# EAGLE design MAPLE-IR-V01 (EAGLE 7.3.0)
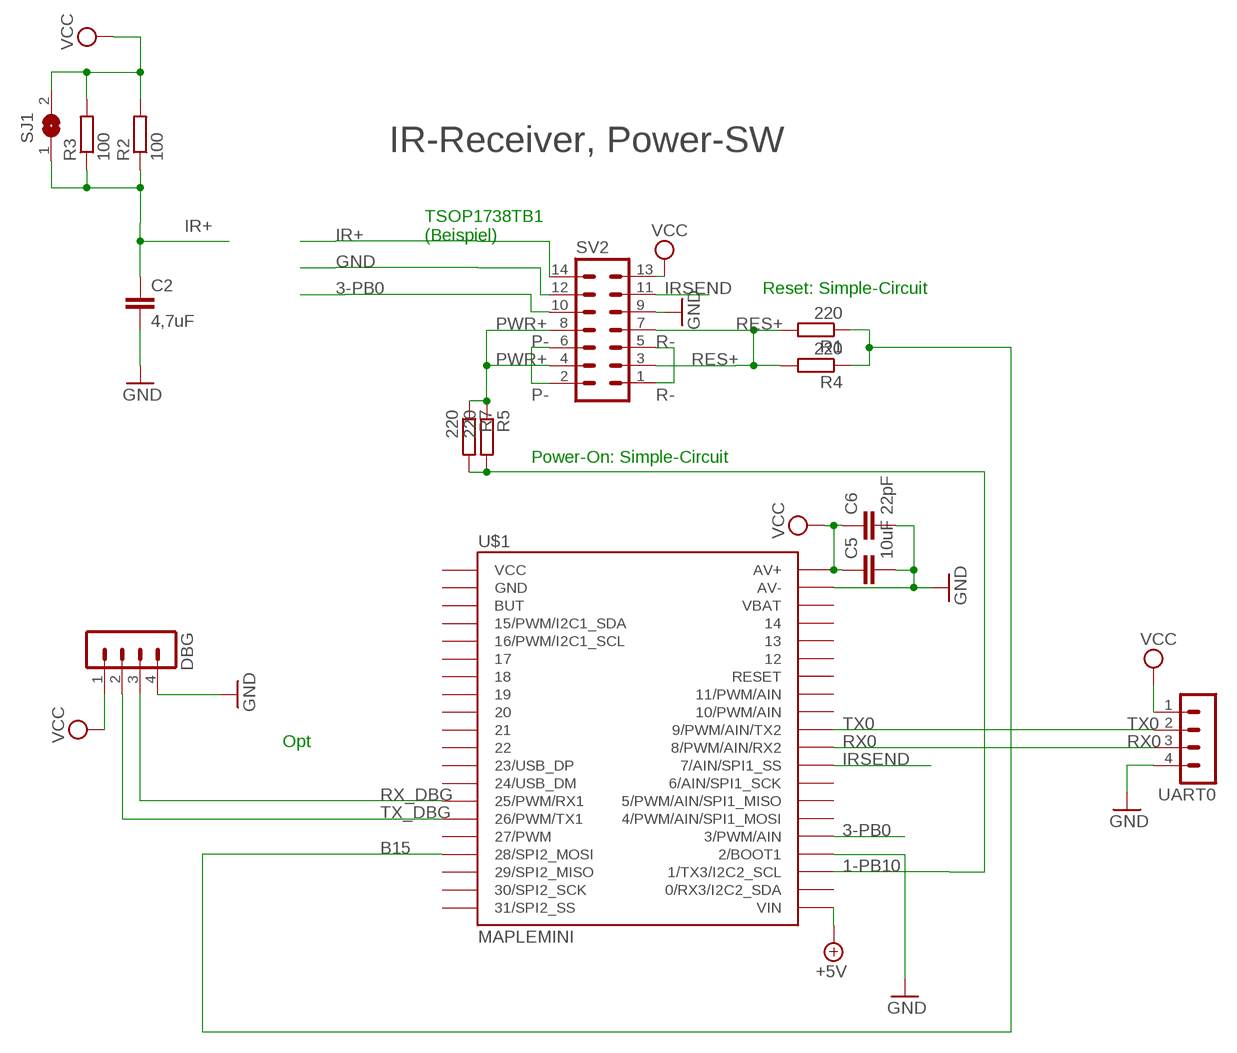
[diagram p0: schematic, sheet 1]

## Parts
C2  4,7uF  C-EUC1206K  [C1206K]
C5  10uF  C-EUC1210  [C1210]
C6  22pF  C-EUC0805  [C0805]
DBG  MA04-1  [MA04-1]
R1  220  R-EU_0204/7  [0204/7]
R2  100  R-EU_0204/7  [0204/7]
R3  100  R-EU_R0805W  [R0805W]
R4  220  R-EU_R0805W  [R0805W]
R5  220  R-EU_0204/7  [0204/7]
R7  220  R-EU_R0805W  [R0805W]
SJ1  SJ  [SJ]
SV2  MA07-2  [MA07-2]
U$1  MAPLEMINI  [20-DIP]
UART0  MA04-1  [MA04-1]

## Nets
1-PB10: R5.2 R7.2 U$1.23(1/TX3/I2C2_SCL)
3-PB0: SV2.10 U$1.25(3/PWM/AIN)
+5V: U$1.21(VIN)
B15: R1.1 R4.1 U$1.17(28/SPI2_MOSI)
GND: C2.2 C5.2 C6.2 DBG.4 SV2.9 SV2.12 U$1.24(2/BOOT1) U$1.39(AV-) UART0.4
IR+: C2.1 R2.1 R3.1 SJ1.1 SV2.14
IRSEND: SV2.11 U$1.29(7/AIN/SPI1_SS)
P-: SV2.2 SV2.6
PWR+: R5.1 R7.1 SV2.4 SV2.8
R-: SV2.1 SV2.5
RES+: R1.2 R4.2 SV2.3 SV2.7
RX0: U$1.30(8/PWM/AIN/RX2) UART0.3
RX_DBG: DBG.3 U$1.14(25/PWM/RX1)
TX0: U$1.31(9/PWM/AIN/TX2) UART0.2
TX_DBG: DBG.2 U$1.15(26/PWM/TX1)
VCC: C5.1 C6.1 DBG.1 R2.2 R3.2 SJ1.2 SV2.13 U$1.40(AV+) UART0.1
Unconnected: U$1.1(VCC) U$1.2(GND) U$1.3(BUT) U$1.4(15/PWM/I2C1_SDA) U$1.5(16/PWM/I2C1_SCL) U$1.6 U$1.7 U$1.8 U$1.9 U$1.10 U$1.11 U$1.12(23/USB_DP) U$1.13(24/USB_DM) U$1.16(27/PWM) U$1.18(29/SPI2_MISO) U$1.19(30/SPI2_SCK) U$1.20(31/SPI2_SS) U$1.22(0/RX3/I2C2_SDA) U$1.26(4/PWM/AIN/SPI1_MOSI) U$1.27(5/PWM/AIN/SPI1_MISO) U$1.28(6/AIN/SPI1_SCK) U$1.32(10/PWM/AIN) U$1.33(11/PWM/AIN) U$1.34(RESET) U$1.35 U$1.36 U$1.37 U$1.38(VBAT)

## Notes on the sheet
- IR-Receiver, Power-SW
- TSOP1738TB1
  (Beispiel)
- Reset: Simple-Circuit
- Power-On: Simple-Circuit
- Opt

## Library data of the parts
C2 C5 C6 = rcl:C-EU: CAPACITOR, European symbol
DBG UART0 = con-lstb:MA04-1: PIN HEADER; OC_FARNELL: unknown; OC_NEWARK: unknown
R1-R5 R7 = rcl:R-EU_: RESISTOR, European symbol
SJ1 = jumper:SJ: SMD solder JUMPER
SV2 = con-lstb:MA07-2: PIN HEADER; OC_FARNELL: unknown; OC_NEWARK: unknown
U$1 = maplemini-small:MAPLEMINI

## Net classes
0 default: width 0.406 mm
1 PWR: width 0.305 mm

## Board
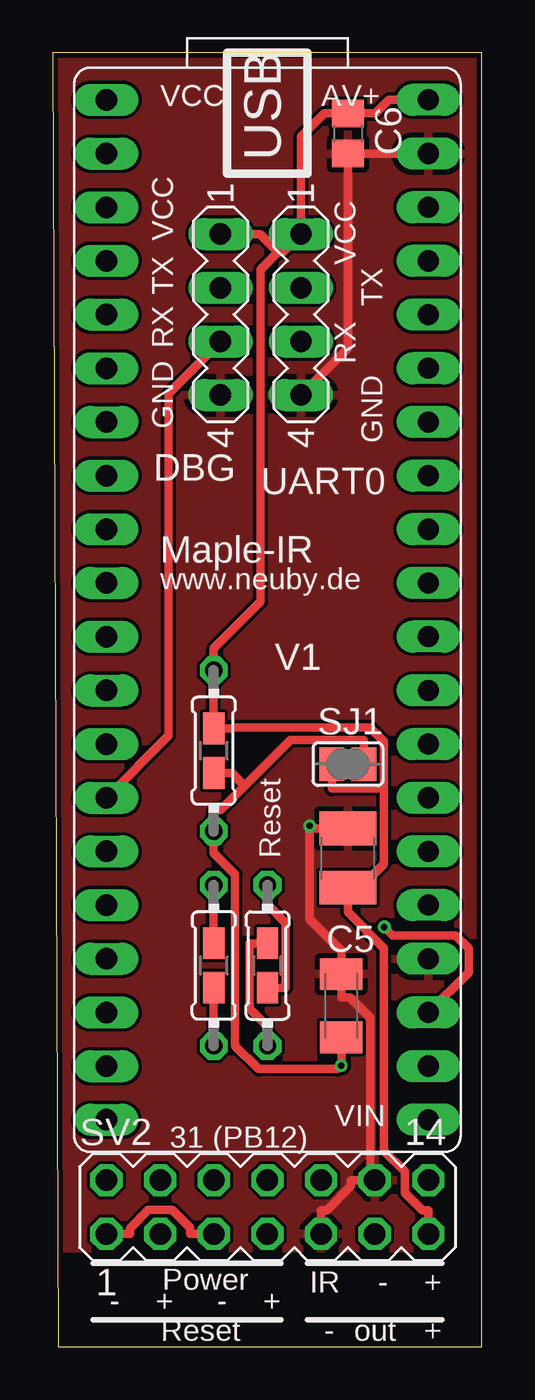
[diagram p1: board, top side]
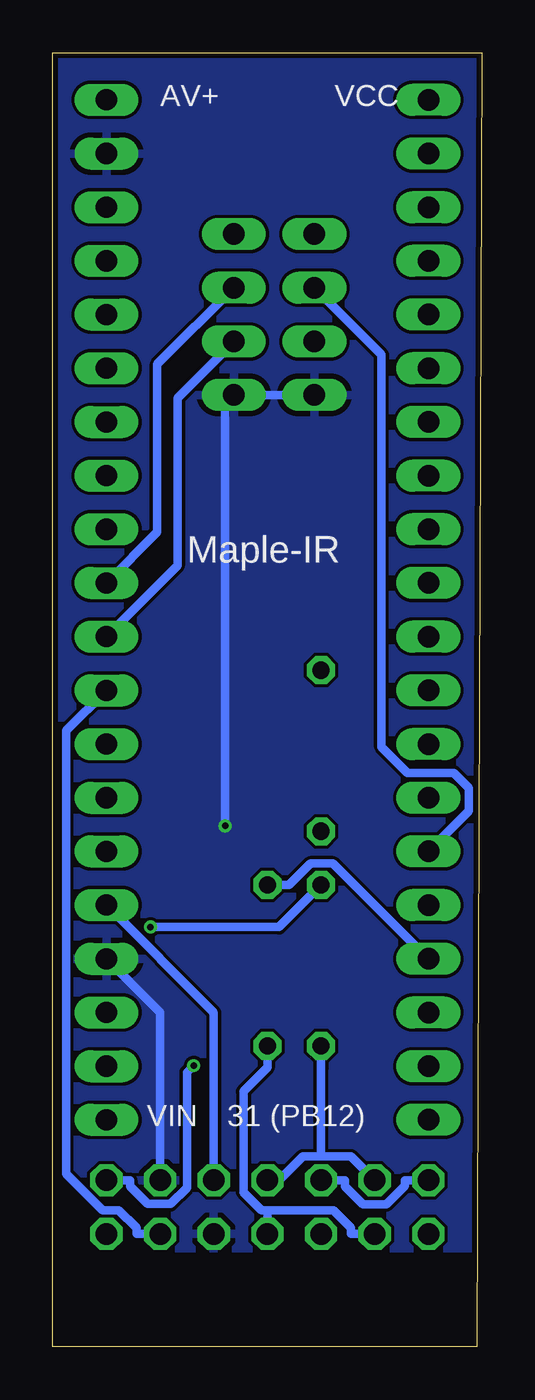
[diagram p2: board, bottom side, seen from below]

Size 20.32 x 61.21 mm. Coordinates in mm from the lower left corner, seen from the top.
Outline: 0,61.21 0.25,0 20.32,0 20.32,61.21 0,61.21
Copper layers (1*16): Top 0.035mm / dielectric 1.5mm / Bottom 0.035mm
Design rules "SeeedStudio_2layer_DRU_no_angle_20140221": minimum track width 6mil, minimum drill 12mil, track to track 6mil, track to pad 6mil, pad to pad 6mil, via to via 6mil, smd to smd 0mil, copper to edge 10mil, drill to drill 10mil, minimum pad ring 10mil, minimum via ring 6mil, stop-mask expansion 2mil, vias tented up to drill 100mil, thermal gap 10mil
tRestrict: area 0.3,0 to 20.3,4.3
bRestrict: area 0.3,0 to 20.3,4.3

### Footprints (pad centres in the part's own frame; a part is rotated, then mirrored left to right if it is on the bottom)
C1206K = smd 1.5 x 2: 1 -1.5,0; 2 1.5,0
C1210 = smd 1.6 x 2.7: 1 -1.4,0; 2 1.4,0
C0805 = smd 1.3 x 1.5: 1 -0.95,0; 2 0.95,0
MA04-1 = drill 1.016 long: 1 -3.81,0; 2 -1.27,0; 3 1.27,0; 4 3.81,0
0204/7 = drill 0.813 octagon: 1 -3.81,0; 2 3.81,0
R0805W = smd 1.5 x 1: 1 -1.052,0; 2 1.052,0
SJ = smd 1.168 x 1.6: 1 -0.762,0; 2 0.762,0
MA07-2 = drill 1.016 octagon: 1 -7.62,-1.27; 2 -7.62,1.27; 3 -5.08,-1.27; 4 -5.08,1.27; 5 -2.54,-1.27; 6 -2.54,1.27; 7 0,-1.27; 8 0,1.27; 9 2.54,-1.27; 10 2.54,1.27; 11 5.08,-1.27; 12 5.08,1.27; 13 7.62,-1.27; 14 7.62,1.27
20-DIP = drill 1.016 pad 1.27 long: 1 -24.13,-7.62; 2 -21.59,-7.62; 3 -19.05,-7.62; 4 -16.51,-7.62; 5 -13.97,-7.62; 6 -11.43,-7.62; 7 -8.89,-7.62; 8 -6.35,-7.62; 9 -3.81,-7.62; 10 -1.27,-7.62; 11 1.27,-7.62; 12 3.81,-7.62; 13 6.35,-7.62; 14 8.89,-7.62; 15 11.43,-7.62; 16 13.97,-7.62; 17 16.51,-7.62; 18 19.05,-7.62; 19 21.59,-7.62; 20 24.13,-7.62 | drill 1 pad 1.27 long: 21 24.13,7.62; 22 21.59,7.62; 23 19.05,7.62; 24 16.51,7.62; 25 13.97,7.62; 26 11.43,7.62; 27 8.89,7.62; 28 6.35,7.62; 29 3.81,7.62; 30 1.27,7.62; 31 -1.27,7.62; 32 -3.81,7.62; 33 -6.35,7.62; 34 -8.89,7.62; 35 -11.43,7.62; 36 -13.97,7.62; 37 -16.51,7.62; 38 -19.05,7.62; 39 -21.59,7.62; 40 -24.13,7.62

### Placement (x,y rotation side)
C2  13.65,16.13 90 top
C5  13.97,23.11 90 top
C6  13.97,57.4 270 top
DBG  7.94,48.83 270 top
R1  10.16,18.03 270 top
R2  7.62,28.19 90 top
R3  7.62,28.19 90 top
R4  10.16,18.03 90 top
R5  7.62,18.03 90 top
R7  7.62,18.03 90 top
SJ1  13.97,27.56 180 top
SV2  10.16,6.6 0 top
U$1  10.16,34.86 270 top
UART0  11.75,48.83 270 top

### Tracks (layer width: path | path; a pad name or v marks a point on that pad's centre or on a via)
1-PB10  (via drill 0.3 pad 0.61)
  Top 0.406: U$1.23 19.68,17.71 19.68,18.84 19.06,19.46 16.08,19.46 v15.69,19.85 | R7.2 R5.2
  Bottom 0.406: R5.2 9.61,19.85 v15.69,19.85
3-PB0
  Bottom 0.406: U$1.25 12.7,15.81 SV2.10
B15
  Top 0.406: R4.1 11.02,16.98 11.02,20.06 10.25,20.83 10.16,20.83 R1.1
  Bottom 0.406: R1.1 9.14,21.84 8.13,22.86 7.05,22.86 U$1.17
GND  (via drill 0.3 pad 0.61)
  Top 0.406: C6.2 | UART0.4 13.97,47.24 C6.2 | C6.2 15.92,56.45 U$1.39 | C5.2 12.26,24.51 12.26,24.54 v12.16,24.64 12.16,20.23 13.65,18.73 C2.2 13.65,16.52 14.06,16.52 15.03,15.55 15.03,7.97 15.13,7.87 | SV2.12 15.13,7.87 | 15.13,7.87 15.04,7.87 14.12,7.87 14.12,7.6 12.97,6.45 12.7,6.45 SV2.9
  Bottom 0.406: DBG.4 UART0.4 12.16,44.61 v12.16,24.64 | U$1.24 15.24,15.81 SV2.12
  pour Bottom: 0,61.21 0,2.79 20.32,2.79 20.32,61.21
  pour Top: 0,61.21 0,2.79 20.32,2.79 20.32,61.21
IR+  (via drill 0.3 pad 0.61)
  Top 0.406: 9.08,26.54 7.94,25.4 7.62,25.4 R2.1 7.62,23.37 8.64,22.35 8.64,14.24 9.74,13.13 13.48,13.13 v13.65,13.3 C2.1 | 9.08,26.54 11.25,28.71 14.73,28.71 SJ1.1 | 9.08,26.54 8.48,27.14 R3.1
  Bottom 0.406: SV2.14 16.66,7.87 16.66,7.6 15.82,6.76 14.73,6.76 13.97,7.52 13.97,12.98 v13.65,13.3
IRSEND
  Bottom 0.406: SV2.11 16.36,5.33 16.36,5.61 17.2,6.45 17.95,6.45 19.68,8.18 19.68,29.15 U$1.29
P-
  Bottom 0.406: SV2.2 3.66,7.87 3.66,7.6 4.52,6.74 5.65,6.74 6.5,7.6 6.5,7.87 SV2.6
PWR+
  Top 0.406: R7.1 R5.1
  Bottom 0.406: 7.62,9 6.2,9 SV2.4 | 7.62,9 8.48,9 9.6,7.87 SV2.8 | 7.62,9 7.62,13.21 R5.1
R-
  Top 0.406: SV2.1 3.66,5.33 3.66,5.61 4.52,6.47 5.65,6.47 6.5,5.61 6.5,5.33 SV2.5
RES+
  Top 0.406: R4.2 9.3,19.09 9.3,16.01 10.07,15.24 10.16,15.24 R1.2
  Bottom 0.406: 10.16,6.45 10.44,6.45 11.29,7.31 11.29,12.07 10.16,13.21 R1.2 | SV2.3 6.2,5.33 6.2,5.61 7.04,6.45 10.16,6.45 | SV2.7 10.16,6.45
RX0
  Bottom 0.406: UART0.3 14.42,44.89 14.42,36.95 U$1.30
RX_DBG
  Top 0.406: U$1.14 5.47,28.91 5.47,45.1 DBG.3
TX0
  Bottom 0.406: U$1.31 15.37,38.54 15.37,46.48 | 15.37,46.48 | 15.37,46.48 UART0.2
TX_DBG
  Bottom 0.406: U$1.15 0.62,25.35 0.62,26.44 1.32,27.14 3.52,27.14 4.76,28.38 4.76,46.92 DBG.2
VCC
  Top 0.406: 10.67,51.79 10.9,51.79 UART0.1 11.75,57.24 12.86,58.35 C6.1 15.28,58.35 15.92,58.99 U$1.40 | 10.67,51.79 9.82,52.64 DBG.1 | 10.67,51.79 9.84,50.97 9.84,35.24 7.62,33.02 R2.2 R3.2 8.48,29.25 8.53,29.3 15.01,29.3 15.68,28.63 15.68,26.4 | 13.97,21.14 15.68,22.85 15.68,26.4 | 15.68,26.4 13.21,26.4 SJ1.2 | 13.97,21.14 13.97,20.56 15.68,18.84 15.68,9.26 16.66,8.28 16.66,7.29 17.5,6.45 17.78,6.45 SV2.13 | C5.1 13.97,21.14

### Text on the board
tNames: VCC | AV+ | USB | VCC | VCC | TX | TX | RX | RX | GND | GND | Maple-IR | www.neuby.de | V1 | Reset | 31 (PB12) | VIN | Power | - | + | - | + | IR | - | + | Reset | - | out | +
bNames: VCC | AV+ | Maple-IR | 31 (PB12) | VIN